# EAGLE schematic PentaFnord_CcsBoard_0_1 (EAGLE 5.11)
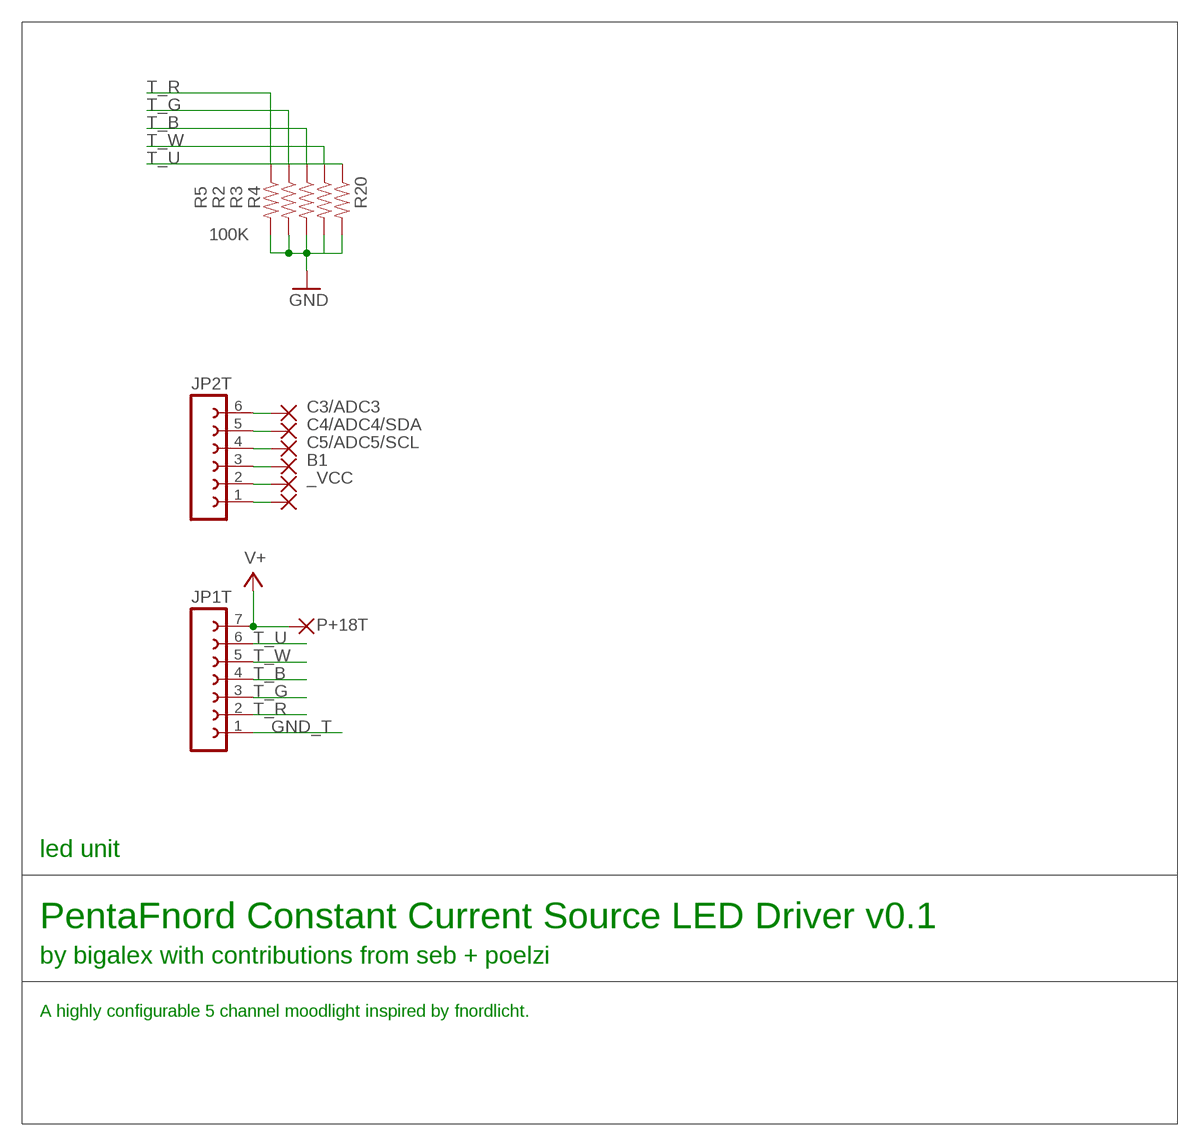
[diagram p0: schematic, sheet 1, part 1 of 2]
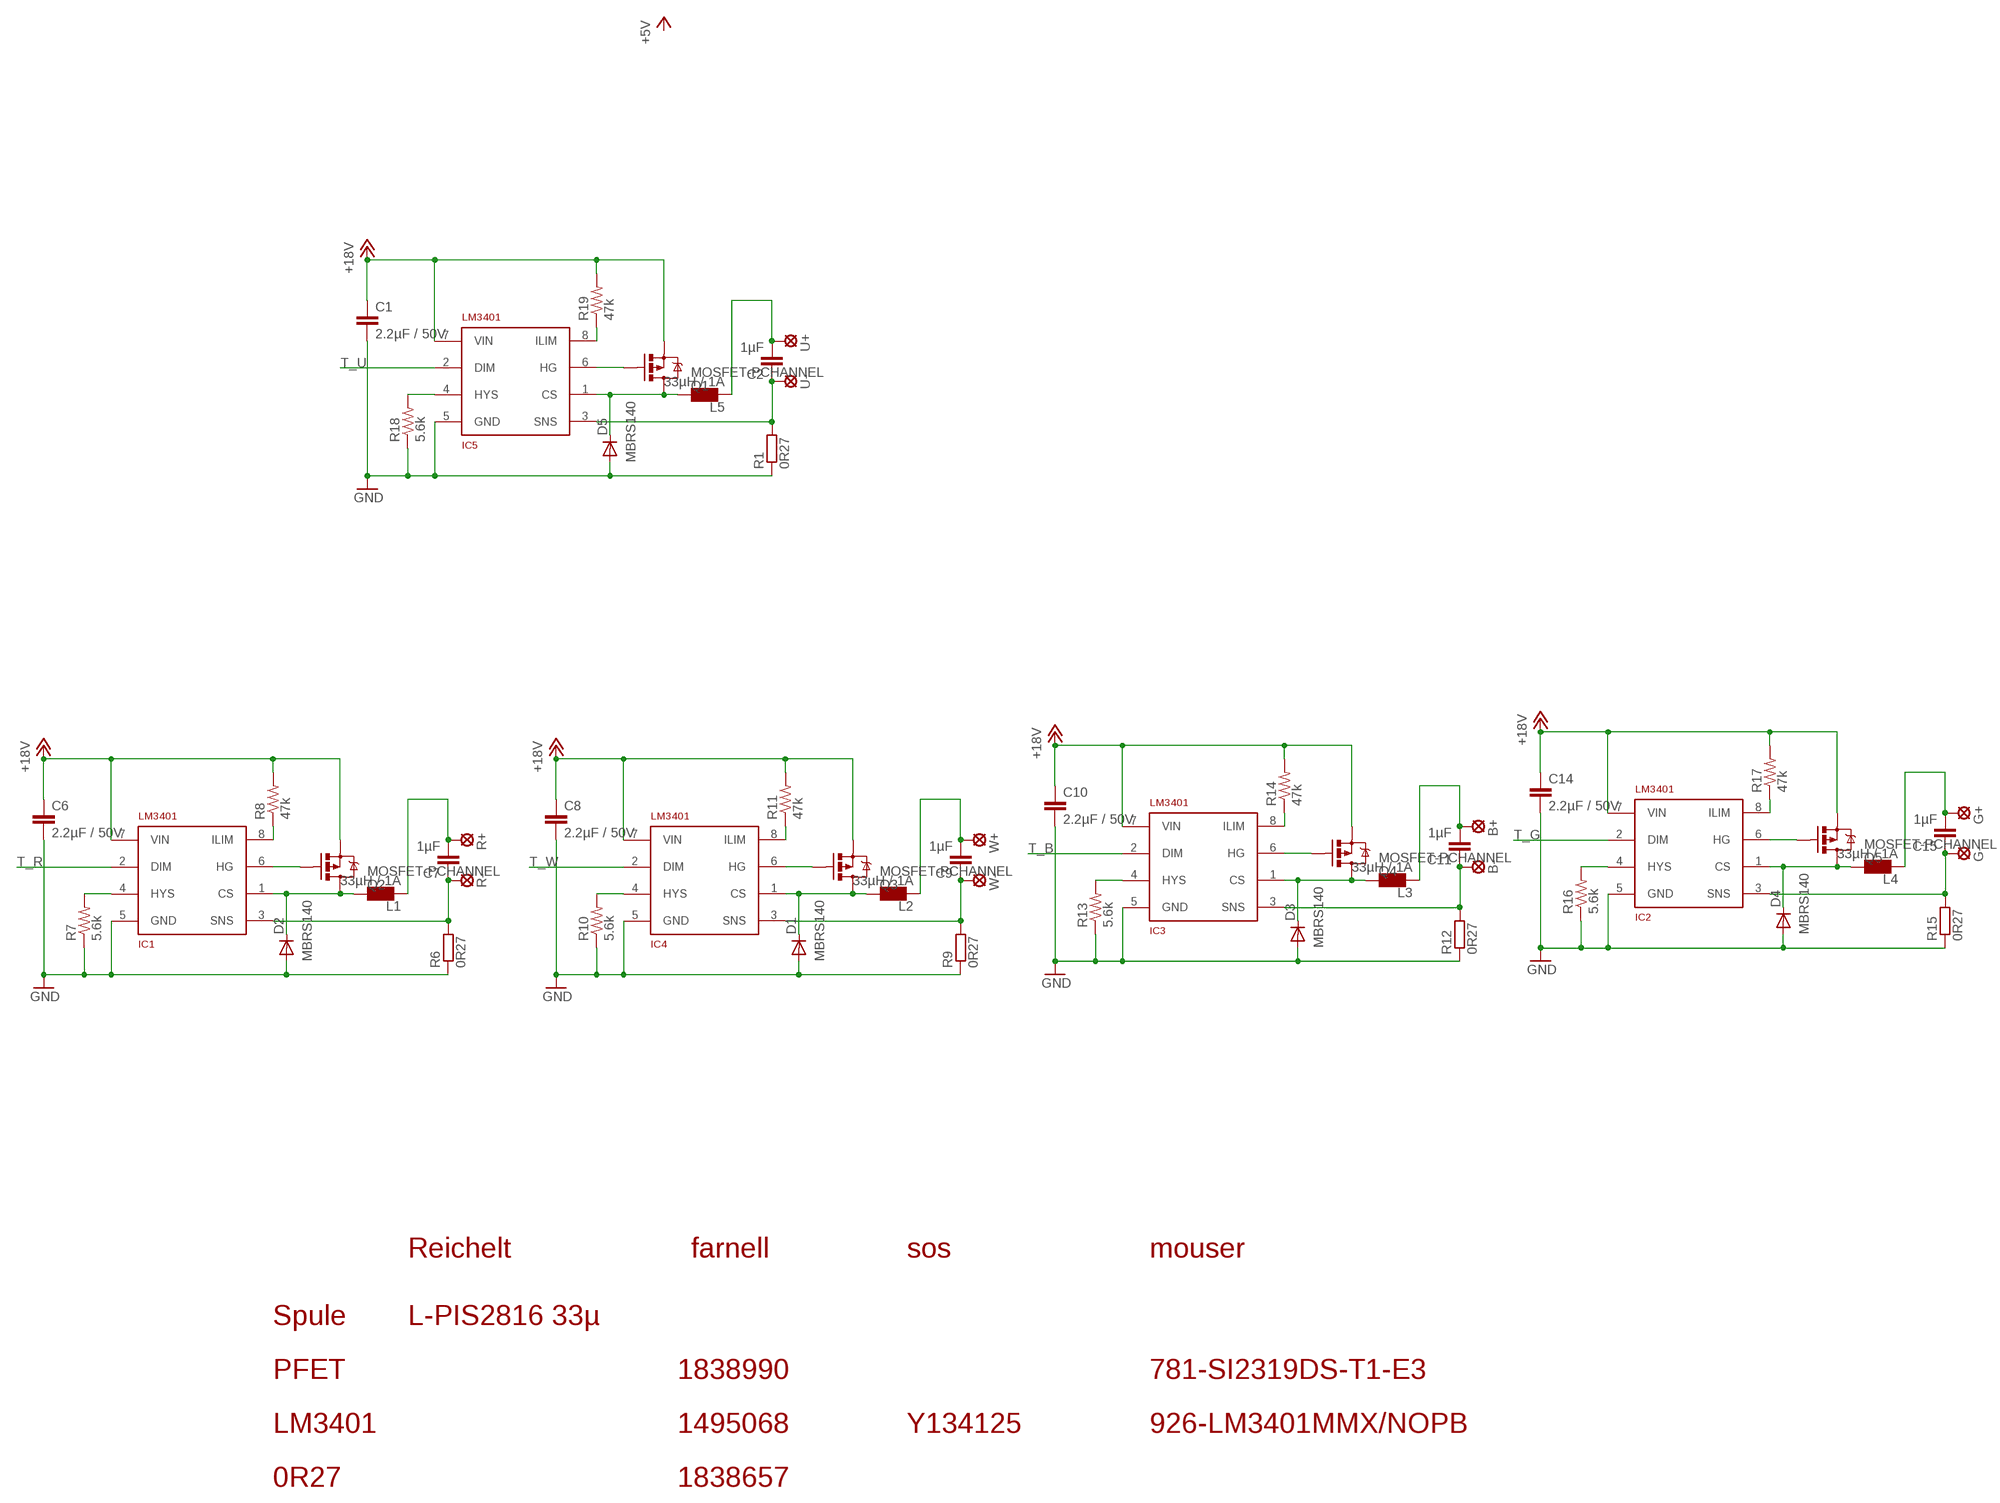
[diagram p1: schematic, sheet 1, part 2 of 2]

## Parts
B+  SE14  [SE14]
B-  SE14  [SE14]
C1  2.2µF / 50V  C-EUC1210  [C1210]
C2  1µF  CAP0805  [0805]
C6  2.2µF / 50V  C-EUC1210  [C1210]
C7  1µF  CAP0805  [0805]
C8  2.2µF / 50V  C-EUC1210  [C1210]
C9  1µF  CAP0805  [0805]
C10  2.2µF / 50V  C-EUC1210  [C1210]
C11  1µF  CAP0805  [0805]
C14  2.2µF / 50V  C-EUC1210  [C1210]
C15  1µF  CAP0805  [0805]
D1  MBRS140  DIODE-SMB  [SMB]
D2  MBRS140  DIODE-SMB  [SMB]
D3  MBRS140  DIODE-SMB  [SMB]
D4  MBRS140  DIODE-SMB  [SMB]
D5  MBRS140  DIODE-SMB  [SMB]
G+  SE14  [SE14]
G-  SE14  [SE14]
IC1  LM3401  [MSOP8]
IC2  LM3401  [MSOP8]
IC3  LM3401  [MSOP8]
IC4  LM3401  [MSOP8]
IC5  LM3401  [MSOP8]
JP1T  FE07-1  [FE07]
JP2T  FE06-1  [FE06]
L1  33µH / 1A  L_PIS2816  [PIS2816]
L2  33µH / 1A  L_PIS2816  [PIS2816]
L3  33µH / 1A  L_PIS2816  [PIS2816]
L4  33µH / 1A  L_PIS2816  [PIS2816]
L5  33µH / 1A  L_PIS2816  [PIS2816]
P+5T  WIREPAD2,54/0,8  [2,54/0,8]
P+18T  WIREPAD2,54/0,8  [2,54/0,8]
PB1T  WIREPAD2,54/0,8  [2,54/0,8]
PC3T  WIREPAD2,54/0,8  [2,54/0,8]
PC4T  WIREPAD2,54/0,8  [2,54/0,8]
PC5T  WIREPAD2,54/0,8  [2,54/0,8]
PGNDT1  WIREPAD2,54/0,8  [2,54/0,8]
Q1  MOSFET-PCHANNEL  [SOT23]
Q2  MOSFET-PCHANNEL  [SOT23]
Q3  MOSFET-PCHANNEL  [SOT23]
Q4  MOSFET-PCHANNEL  [SOT23]
Q5  MOSFET-PCHANNEL  [SOT23]
R1  0R27  R-EU_R1206  [R1206]
R2  100K  RESISTOR0402-RES  [0402-RES]
R3  100K  RESISTOR0402-RES  [0402-RES]
R4  100K  RESISTOR0402-RES  [0402-RES]
R5  100K  RESISTOR0402-RES  [0402-RES]
R6  0R27  R-EU_R1206  [R1206]
R7  5.6k  RESISTOR0805-RES  [0805]
R8  47k  RESISTOR0805-RES  [0805]
R9  0R27  R-EU_R1206  [R1206]
R10  5.6k  RESISTOR0805-RES  [0805]
R11  47k  RESISTOR0805-RES  [0805]
R12  0R27  R-EU_R1206  [R1206]
R13  5.6k  RESISTOR0805-RES  [0805]
R14  47k  RESISTOR0805-RES  [0805]
R15  0R27  R-EU_R1206  [R1206]
R16  5.6k  RESISTOR0805-RES  [0805]
R17  47k  RESISTOR0805-RES  [0805]
R18  5.6k  RESISTOR0805-RES  [0805]
R19  47k  RESISTOR0805-RES  [0805]
R20  100K  RESISTOR0402-RES  [0402-RES]
R+  SE14  [SE14]
R-  SE14  [SE14]
U+  SE14  [SE14]
U-  SE14  [SE14]
W+  SE14  [SE14]
W-  SE14  [SE14]

## Nets
+18V: C1.1 C6.1 C8.1 C10.1 C14.1 IC1.7(VIN) IC2.7(VIN) IC3.7(VIN) IC4.7(VIN) IC5.7(VIN) JP1T.7 P+18T.1(P) Q1.2(S) Q2.2(S) Q3.2(S) Q4.2(S) Q5.2(S) R8.2 R11.2 R14.2 R17.2 R19.2 ; supply symbol labelled V+
_VCC: JP2T.2 P+5T.1(P)
B1: JP2T.3 PB1T.1(P)
C3/ADC3: JP2T.6 PC3T.1(P)
C4/ADC4/SDA: JP2T.5 PC4T.1(P)
C5/ADC5/SCL: JP2T.4 PC5T.1(P)
GND_T: C1.2 C6.2 C8.2 C10.2 C14.2 D1.A D2.A D3.A D4.A D5.A IC1.5(GND) IC2.5(GND) IC3.5(GND) IC4.5(GND) IC5.5(GND) JP1T.1 JP2T.1 PGNDT1.1(P) R1.1 R2.2 R3.2 R4.2 R5.2 R6.1 R7.1 R9.1 R10.1 R12.1 R13.1 R15.1 R16.1 R18.1 R20.2 ; supply symbol labelled GND
N$1: C7.1 IC1.3(SNS) R6.2 R-.MP
N$2: C7.2 L1.P$2 R+.MP
N$3: D2.C IC1.1(CS) L1.P$1 Q2.3(D)
N$4: C9.1 IC4.3(SNS) R9.2 W-.MP
N$5: IC1.4(HYS) R7.2
N$6: C9.2 L2.P$2 W+.MP
N$7: IC1.8(ILIM) R8.1
N$8: D1.C IC4.1(CS) L2.P$1 Q3.3(D)
N$9: IC4.4(HYS) R10.2
N$10: IC1.6(HG) Q2.1(G)
N$11: IC4.8(ILIM) R11.1
N$12: IC4.6(HG) Q3.1(G)
N$13: B-.MP C11.1 IC3.3(SNS) R12.2
N$14: B+.MP C11.2 L3.P$2
N$15: D3.C IC3.1(CS) L3.P$1 Q4.3(D)
N$16: IC3.4(HYS) R13.2
N$17: IC3.8(ILIM) R14.1
N$18: C2.1 IC5.3(SNS) R1.2 U-.MP
N$19: C2.2 L5.P$2 U+.MP
N$20: IC3.6(HG) Q4.1(G)
N$21: C15.1 G-.MP IC2.3(SNS) R15.2
N$22: C15.2 G+.MP L4.P$2
N$23: D4.C IC2.1(CS) L4.P$1 Q5.3(D)
N$24: IC2.4(HYS) R16.2
N$25: IC2.8(ILIM) R17.1
N$26: IC2.6(HG) Q5.1(G)
N$27: D5.C IC5.1(CS) L5.P$1 Q1.3(D)
N$28: IC5.4(HYS) R18.2
N$29: IC5.8(ILIM) R19.1
N$30: IC5.6(HG) Q1.1(G)
T_B: IC3.2(DIM) JP1T.4 R3.1
T_G: IC2.2(DIM) JP1T.3 R2.1
T_R: IC1.2(DIM) JP1T.2 R5.1
T_U: IC5.2(DIM) JP1T.6 R20.1
T_W: IC4.2(DIM) JP1T.5 R4.1

## Notes on the sheet
- led unit
- PentaFnord Constant Current Source LED Driver v0.1
- by bigalex with contributions from seb + poelzi
- A highly configurable 5 channel moodlight inspired by fnordlicht.
- Reichelt | farnell | sos | mouser
- Spule | L-PIS2816 33µ
- PFET | 1838990 | 781-SI2319DS-T1-E3
- LM3401 | 1495068 | Y134125 | 926-LM3401MMX/NOPB
- 0R27 | 1838657

## Library data of the parts
B+ B- G+ G- R+ R- U+ U- W+ W- = solpad:SE14: SOLDER PAD E1553, drill 1,4mm, distributor Buerklin, 07F820
C1 C6 C8 C10 C14 = rcl:C-EU: CAPACITOR, European symbol
C2 C7 C9 C11 C15 = SparkFun:CAP: Capacitor Standard 0603 ceramic capacitor, and 0.1" leaded capacitor.
D1-D5 = diode:DIODE-: DIODE
IC1-IC5 = seb:LM3401
JP1T = con-lsta:FE07-1: FEMALE HEADER; OC_FARNELL: unknown; OC_NEWARK: unknown
JP2T = con-lsta:FE06-1: FEMALE HEADER; OC_FARNELL: unknown; OC_NEWARK: unknown
L1-L5 = seb:L_PIS2816
P+5T P+18T PB1T PC3T PC4T PC5T PGNDT1 = wirepad:WIREPAD: Wire PAD connect wire on PCB
Q1-Q5 = SparkFun:MOSFET-PCHANNEL
R1 R6 R9 R12 R15 = rcl:R-EU_: RESISTOR, European symbol
R2-R5 R7 R8 R10 R11 R13 R14 R16-R20 = SparkFun:RESISTOR: Resistor Basic schematic elements and footprints for 0603, 1206, and PTH resistors.